# Altium schematic sheet TopLevel.SchDoc
size A4; SheetNumber: 4; SheetTotal: 4
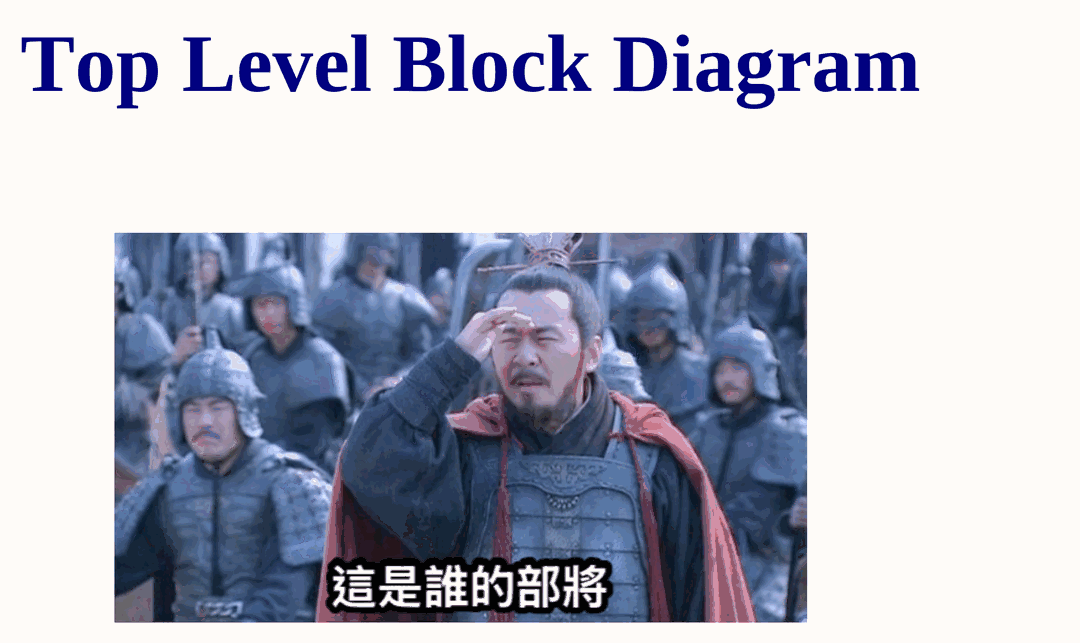
[diagram p0: TopLevel.SchDoc]

## Notes on the sheet
- Top Level Block Diagram